# EAGLE design clock (EAGLE 9.6.2)
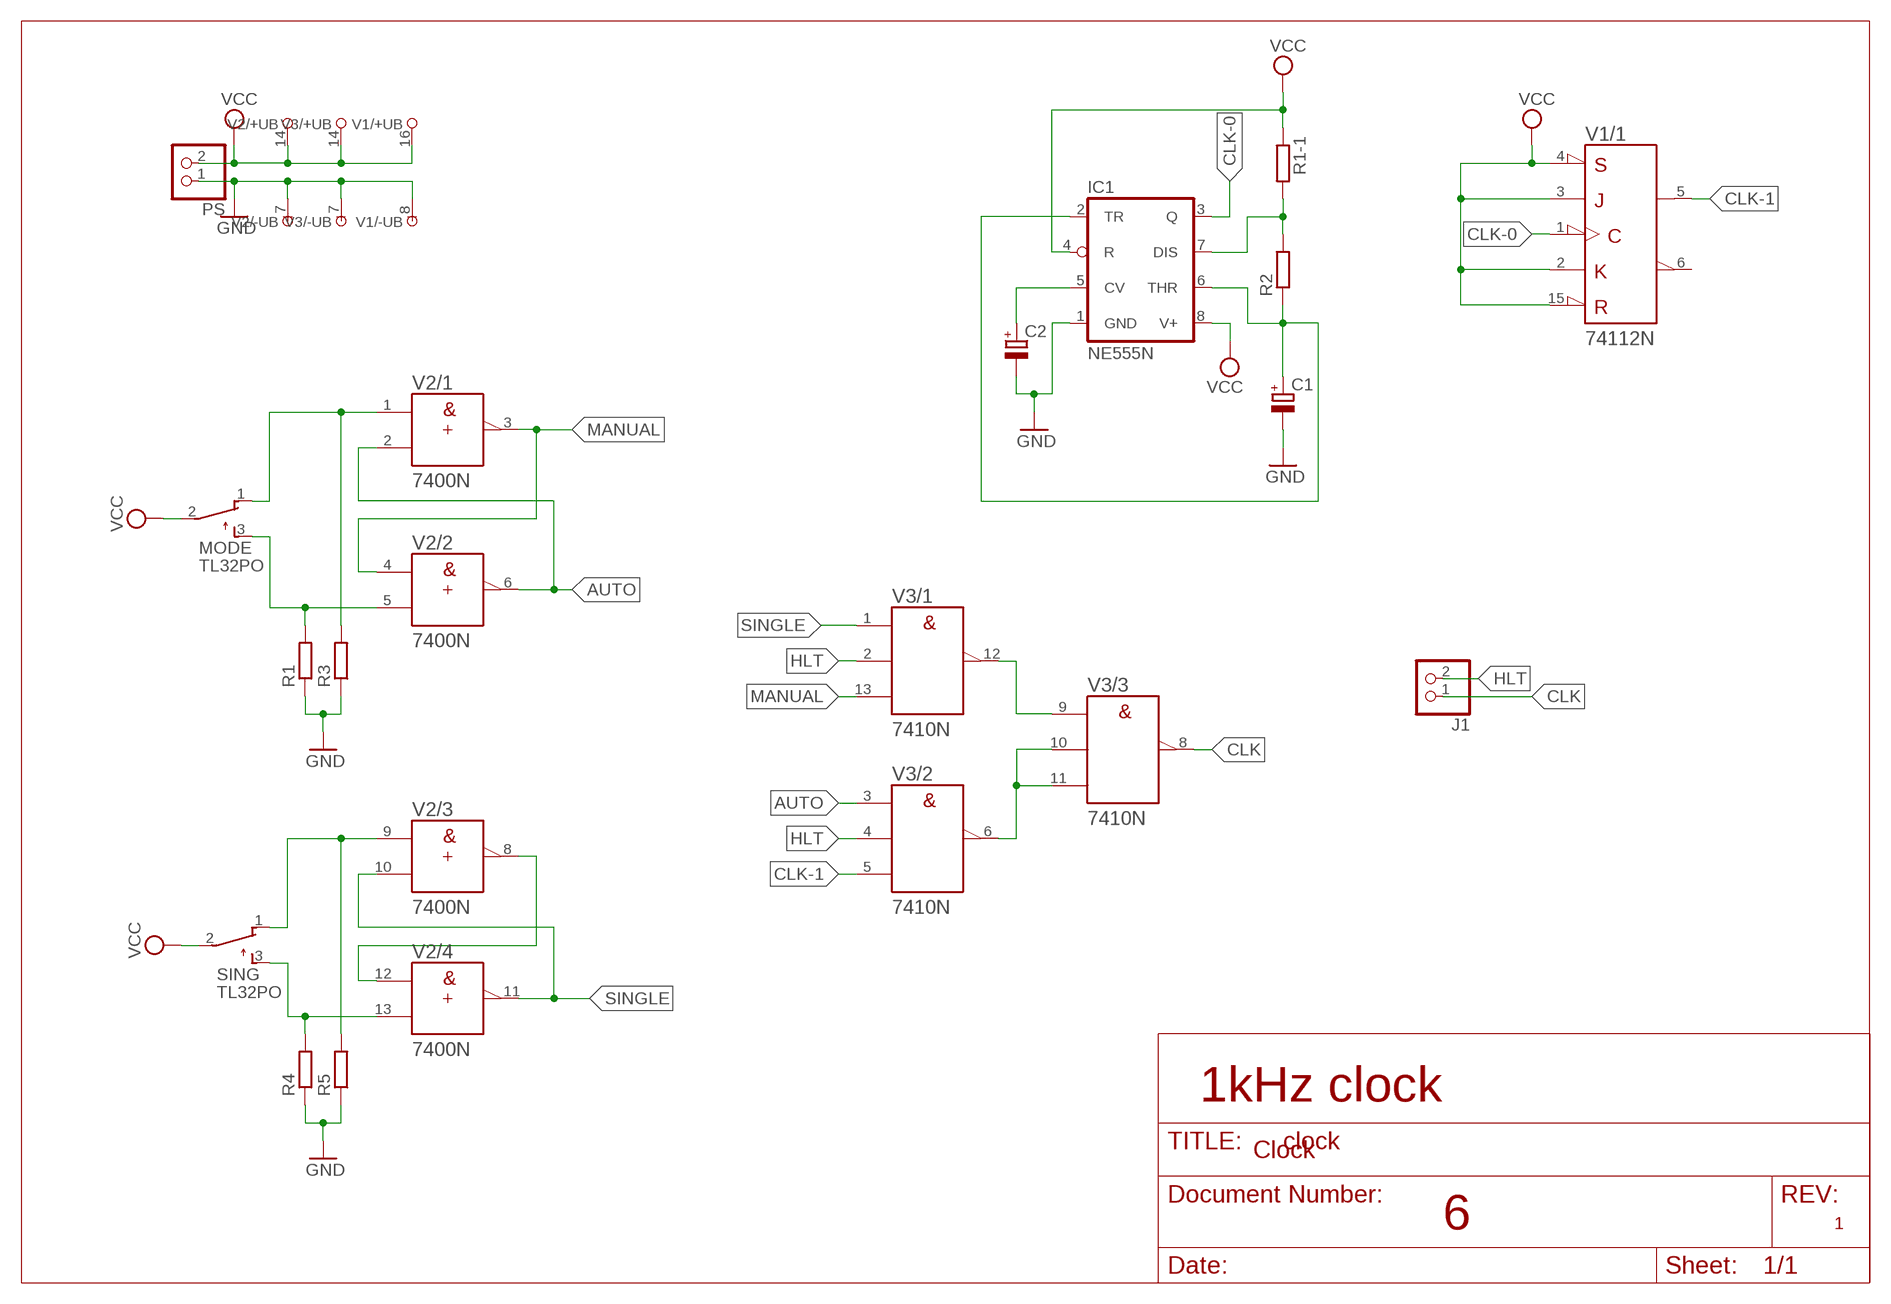
[diagram p0: schematic, sheet 1]

## Parts
C1  CPOL-EUE2.5-6  [E2,5-6]
C2  CPOL-EUE2.5-6  [E2,5-6]
IC1  NE555N  [DIL08]
J1  PINHD-1X2  [1X02]
MODE  TL32PO  [TL3XPO]
PS  PINHD-1X2  [1X02]
R1  R-EU_0204/7  [0204/7]
R1-1  R-EU_0207/10  [0207/10]
R2  R-EU_0207/10  [0207/10]
R3  R-EU_0204/7  [0204/7]
R4  R-EU_0204/7  [0204/7]
R5  R-EU_0204/7  [0204/7]
SING  TL32PO  [TL3XPO]
V1  74112N  [DIL16]
V2  7400N  [DIL14]
V3  7410N  [DIL14]

## Nets
AUTO: V2.2(/1:B) V2.6(/2:Y) V3.3(/2:A)
CLK: J1.1 V3.8(/3:Y)
CLK-0: IC1.3(Q) V1.1(/1:CLK)
CLK-1: V1.5(/1:Q) V3.5(/2:C)
GND: C1.- C2.- IC1.1(GND) PS.1 R1.1 R3.1 R4.1 R5.1 V1.8(/-UB:-UB) V2.7(/-UB:-UB) V3.7(/-UB:-UB)
HLT: J1.2 V3.2(/1:B) V3.4(/2:B)
MANUAL: V2.3(/1:Y) V2.4(/2:A) V3.13(/1:C)
N$1: C1.+ IC1.2(TR) IC1.6(THR) R2.1
N$2: IC1.7(DIS) R1-1.2 R2.2
N$3: C2.+ IC1.5(CV)
N$7: MODE.1(O) R3.2 V2.1(/1:A)
N$8: MODE.3(S) R1.2 V2.5(/2:B)
N$11: R5.2 SING.1(O) V2.9(/3:A)
N$12: R4.2 SING.3(S) V2.13(/4:B)
N$13: V2.8(/3:Y) V2.12(/4:A)
N$17: V3.6(/2:Y) V3.10(/3:B) V3.11(/3:C)
N$18: V3.9(/3:A) V3.12(/1:Y)
SINGLE: V2.10(/3:B) V2.11(/4:Y) V3.1(/1:A)
VCC: IC1.4(R) IC1.8(V+) MODE.2(P) PS.2 R1-1.1 SING.2(P) V1.2(/1:K) V1.3(/1:J) V1.4(/1:!PRE) V1.15(/1:!CLR) V1.16(/+UB:+UB) V2.14(/+UB:+UB) V3.14(/+UB:+UB)
Unconnected: V1.6(/1:!Q) V1.7(/2:!Q) V1.9(/2:Q) V1.10(/2:!PRE) V1.11(/2:J) V1.12(/2:K) V1.13(/2:CLK) V1.14(/2:!CLR)

## Notes on the sheet
- 1kHz clock
- Clock
- 6 | 1

## Library data of the parts
C1 C2 = rcl:CPOL-EU: POLARIZED CAPACITOR, European symbol; SPICEPREFIX: C
IC1 = linear:*555: TIMER
J1 PS = pinhead:PINHD-1X2: PIN HEADER
MODE SING = switch:TL32PO: TINY SWITCH ON - MOM Source: http://www2.produktinfo.conrad.com/datenblaetter/700000-724999/705152-da-01-de-Subminiaturschalter_TL_36YO.pdf
R1 R1-1 R2-R5 = rcl:R-EU_: RESISTOR, European symbol; SPICEPREFIX: R
V1 = 74ttl-din:74*112: Dual J-K negative edge triggered FLIP FLOP, preset and clear
V2 = 74ttl-din:74*00: Quad 2-input NAND gate
V3 = 74ttl-din:74*10: Triple 3-input NAND gate

## Board
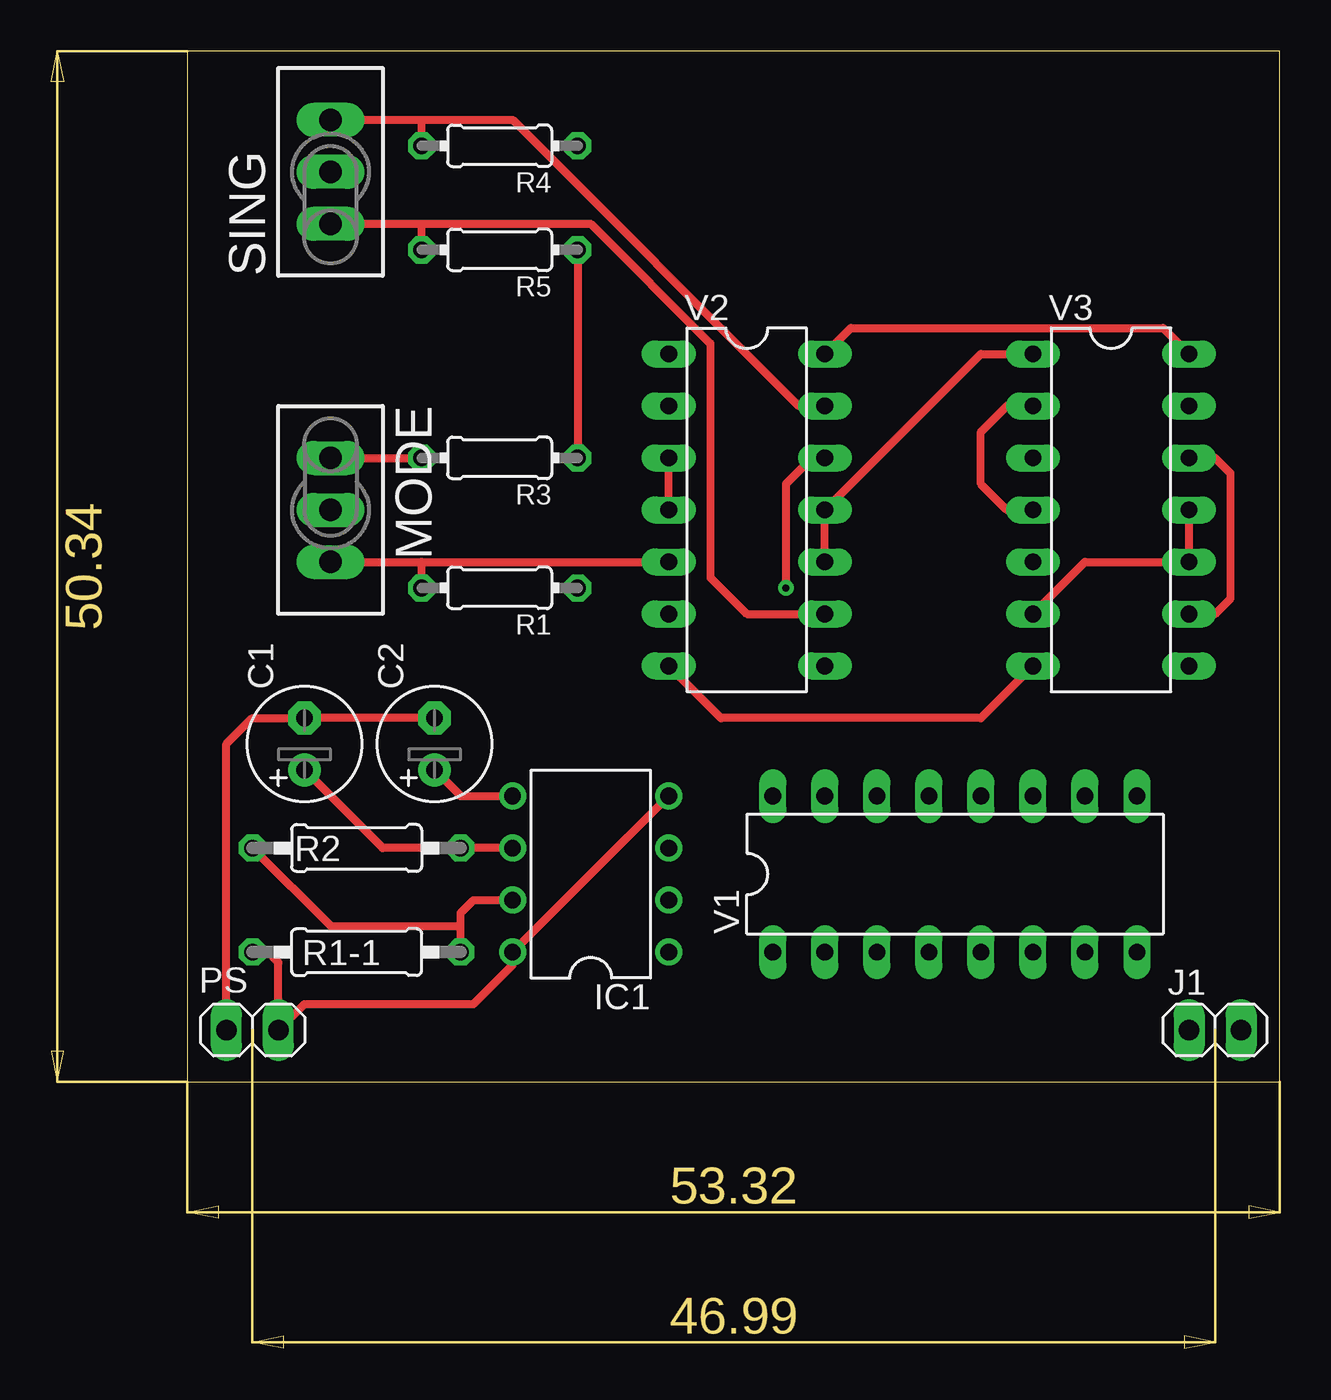
[diagram p1: board, top side]
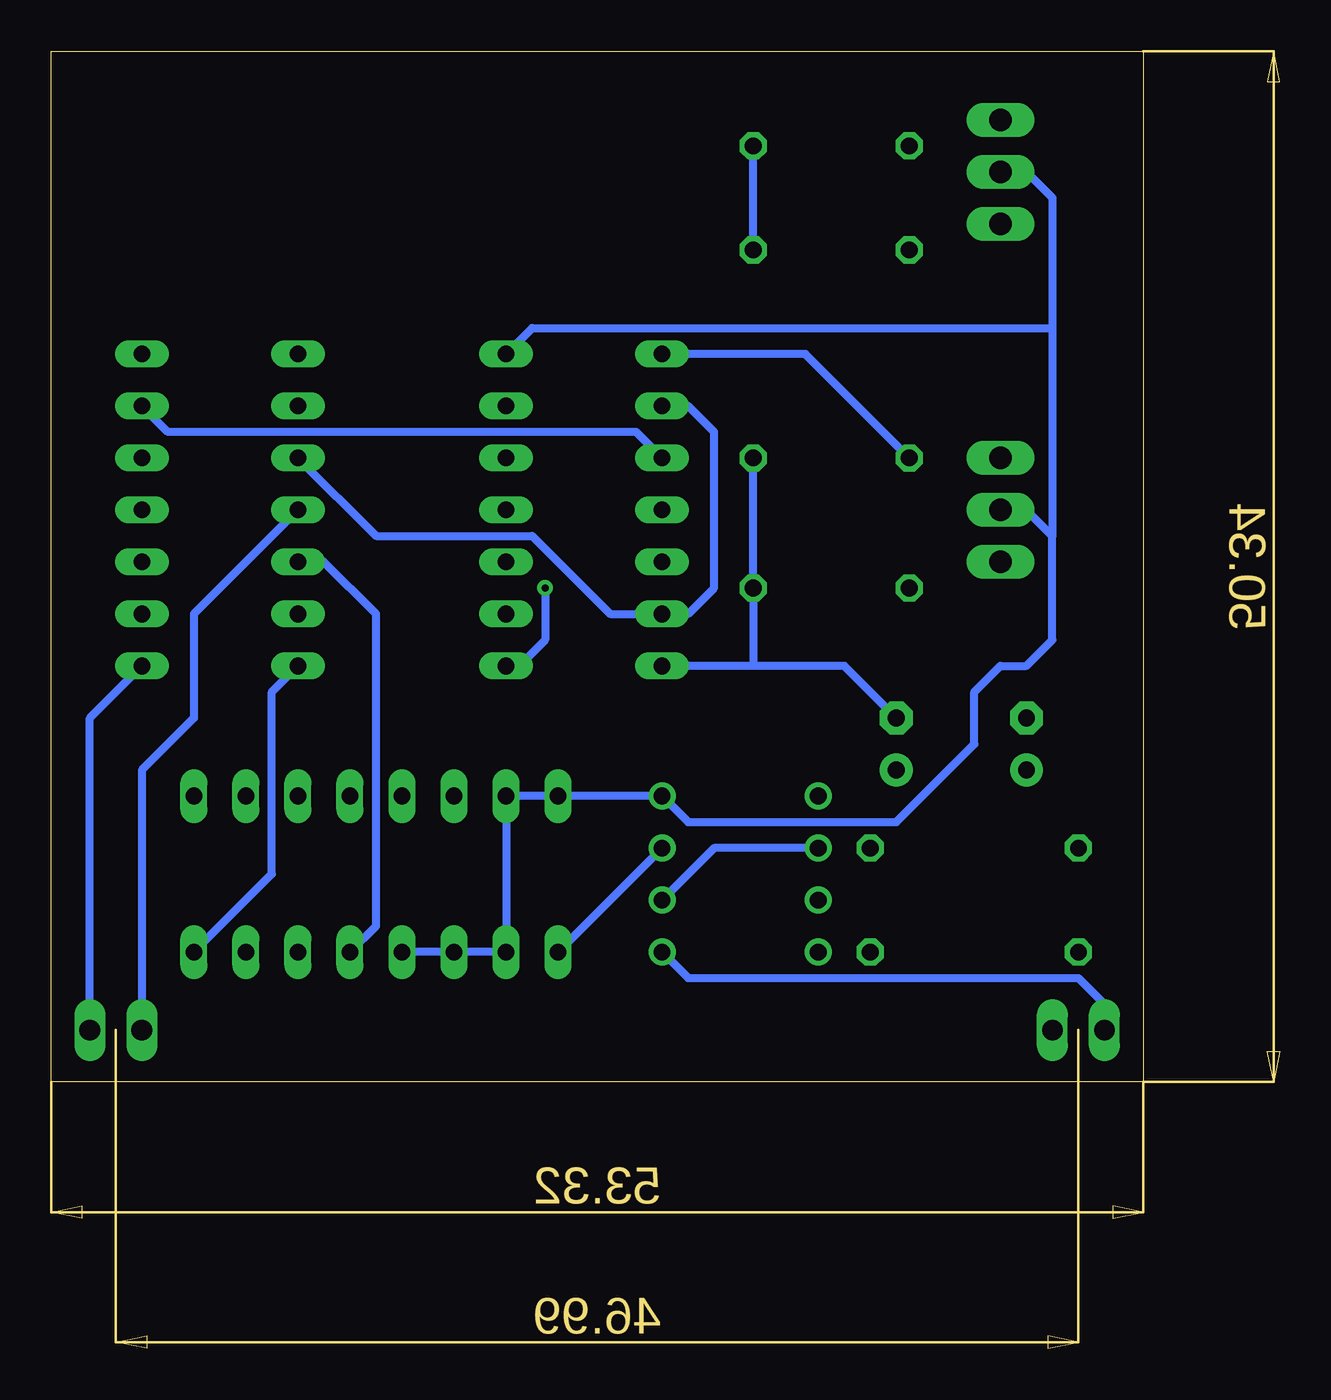
[diagram p2: board, bottom side, seen from below]

Size 53.32 x 50.34 mm. Coordinates in mm from the lower left corner, seen from the top.
Outline: 0,0 53.32,0 53.32,50.34 0,50.34 0,0
Copper layers (1*16): Top 0.035mm / dielectric 1.5mm / Bottom 0.035mm
Design rules "default": minimum track width 6mil, minimum drill 0.35mm, track to track 6mil, track to pad 6mil, pad to pad 6mil, via to via 6mil, smd to smd 6mil, copper to edge 40mil, drill to drill 6mil, minimum pad ring 10mil, minimum via ring 8mil, stop-mask expansion 4mil, vias tented up to drill 0mil, thermal gap 10mil

### Footprints (pad centres in the part's own frame; a part is rotated, then mirrored left to right if it is on the bottom)
E2,5-6 = drill 0.813 pad 1.6: + -1.27,0 | drill 0.813 pad 1.6 octagon: - 1.27,0
DIL08 = drill 0.813 pad 1.27: 1 -3.81,-3.81; 2 -1.27,-3.81; 3 1.27,-3.81; 4 3.81,-3.81; 5 3.81,3.81; 6 1.27,3.81; 7 -1.27,3.81; 8 -3.81,3.81
1X02 = drill 1.016 long: 1 -1.27,0; 2 1.27,0
TL3XPO = drill 1.1 pad 1.422 long: 1 -2.54,0; 2 0,0; 3 2.54,0
0204/7 = drill 0.813 octagon: 1 -3.81,0; 2 3.81,0
0207/10 = drill 0.813 octagon: 1 -5.08,0; 2 5.08,0
DIL16 = drill 0.813 long: 1 -8.89,-3.81; 2 -6.35,-3.81; 3 -3.81,-3.81; 4 -1.27,-3.81; 5 1.27,-3.81; 6 3.81,-3.81; 7 6.35,-3.81; 8 8.89,-3.81; 9 8.89,3.81; 10 6.35,3.81; 11 3.81,3.81; 12 1.27,3.81; 13 -1.27,3.81; 14 -3.81,3.81; 15 -6.35,3.81; 16 -8.89,3.81
DIL14 = drill 0.813 long: 1 -7.62,-3.81; 2 -5.08,-3.81; 3 -2.54,-3.81; 4 0,-3.81; 5 2.54,-3.81; 6 5.08,-3.81; 7 7.62,-3.81; 8 7.62,3.81; 9 5.08,3.81; 10 2.54,3.81; 11 0,3.81; 12 -2.54,3.81; 13 -5.08,3.81; 14 -7.62,3.81

### Placement (x,y rotation side)
C1  5.71,16.51 90 top
C2  12.06,16.51 90 top
IC1  19.68,10.16 90 top
J1  50.16,2.54 180 top
MODE  6.99,27.94 270 top
PS  3.17,2.54 0 top
R1  15.24,24.13 180 top
R1-1  8.26,6.35 0 top
R2  8.26,11.43 180 top
R3  15.24,30.48 180 top
R4  15.24,45.72 180 top
R5  15.24,40.64 180 top
SING  6.99,44.45 90 top
V1  37.47,10.16 0 top
V2  27.3,27.94 270 top
V3  45.09,27.94 270 top

### Tracks (layer width: path | path; a pad name or v marks a point on that pad's centre or on a via)
AUTO
  Bottom 0.4: V2.2 22.23,33.02 20.95,31.75 20.95,24.13 22.23,22.86 V2.6 26.04,22.86 29.84,26.67 37.47,26.67 V3.3
CLK
  Bottom 0.4: J1.1 51.44,17.78 V3.8
CLK-0
  Bottom 0.4: IC1.3 V1.1
CLK-1
  Bottom 0.4: V1.5 37.47,7.62 37.47,22.86 40.01,25.4 V3.5
GND
  Top 0.4: PS.1 1.91,16.51 3.17,17.78 C1.- C2.- | V3.7 38.73,17.78 26.04,17.78 V2.7 | R5.1 R3.1
  Bottom 0.4: IC1.1 22.23,5.08 3.17,5.08 1.91,3.81 PS.1 | V1.8 42.55,10.16 42.55,19.05 V3.7 | C2.- 14.61,20.32 19.05,20.32 | 19.05,20.32 V2.7 | 19.05,20.32 R1.1 R3.1 | R5.1 R4.1
HLT
  Top 0.4: V3.4 40.01,27.94 38.73,29.21 38.73,31.75 40.01,33.02 V3.2
  Bottom 0.4: V3.4 46.35,22.86 46.35,17.78 48.9,15.24 J1.2
MANUAL
  Top 0.4: V2.4 V2.3
  Bottom 0.4: V2.3 24.77,31.75 47.62,31.75 V3.13
N$1
  Top 0.4: IC1.6 R2.1 9.53,11.43 C1.+
  Bottom 0.4: IC1.6 20.95,11.43 IC1.2
N$2
  Top 0.4: R1-1.2 13.34,7.62 | 13.34,7.62 13.34,8.26 13.97,8.89 IC1.7 | R2.2 6.99,7.62 13.34,7.62
N$3
  Top 0.4: C2.+ 13.34,13.97 IC1.5
N$7
  Top 0.4: MODE.1 R3.2
  Bottom 0.4: R3.2 16.51,35.56 V2.1
N$8
  Top 0.4: MODE.3 11.43,25.4 | 11.43,25.4 V2.5 | R1.2 11.43,25.4
N$11
  Top 0.4: SING.1 11.43,41.91 | 11.43,41.91 19.68,41.91 25.53,36.07 25.53,24.64 27.3,22.86 V2.9 | R5.2 11.43,41.91
N$12
  Top 0.4: SING.3 11.43,46.99 | 11.43,46.99 15.88,46.99 29.84,33.02 V2.13 | R4.2 11.43,46.99
N$13  (via drill 0.35)
  Top 0.4: V2.12 30.48,30.48 29.21,29.21 v29.21,24.13
  Bottom 0.4: v29.21,24.13 29.21,21.59 30.48,20.32 V2.8
N$17
  Top 0.4: V3.6 43.81,25.4 V3.10 V3.11
N$18
  Top 0.4: V3.9 50.16,22.86 50.93,23.62 50.93,29.72 50.16,30.48 V3.12
SINGLE
  Top 0.4: V3.1 38.73,35.56 V2.11 V2.10
VCC
  Top 0.4: IC1.4 IC1.8 15.88,5.71 13.97,3.81 5.71,3.81 PS.2 4.45,5.84 3.94,6.35 R1-1.1 | V2.14 32.38,36.83 47.62,36.83 V3.14
  Bottom 0.4: V1.4 V1.3 V1.2 V1.15 V1.16 IC1.4 22.23,12.7 12.06,12.7 8.26,16.51 8.26,19.05 6.99,20.32 5.71,20.32 4.45,21.59 4.45,26.67 | 4.45,26.67 5.71,27.94 MODE.2 | SING.2 5.71,44.45 4.45,43.18 4.45,36.83 | 4.45,36.83 4.45,26.67 | V2.14 29.84,36.83 4.45,36.83